# Altium schematic sheet rtc_blk - Copy.SchDoc
size A4; Engineer: JBayalas; DocumentNumber: 8; Revision: V5.0; SheetNumber: 8; SheetTotal: 10
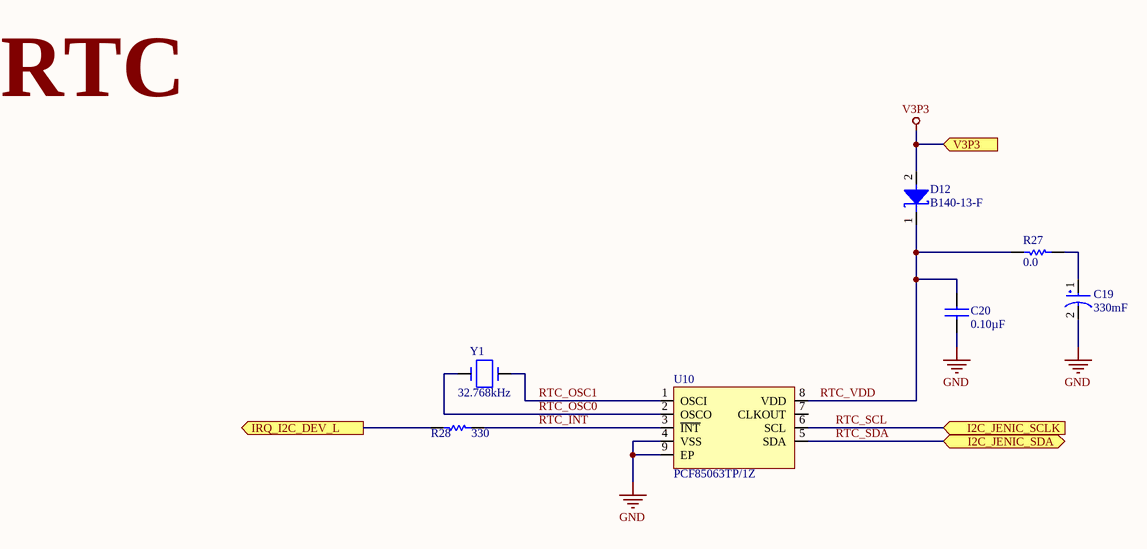
[diagram p0: rtc_blk - Copy.SchDoc]

## Parts
C19  value 330mF  [ELNA_DSK-3R3H334T-HL]  (hidden comment: DSK-3R3H334T-HL)
C20  value 0.10µF  [C0402]  (hidden comment: GRM155R71H104ME14D)
D12  value B140-13-F  [DO-214AC, SMA]  (hidden comment: *)
R27  value 0.0  [R0402]  (hidden comment: *)
R28  value 330  [R0402]  (hidden comment: *)
U10  PCF85063TP/1Z  [SON9P50_200X300X80L40X24T150N]
Y1  value 32.768kHz  [XTAL320X150X80L75X150N]  (hidden comment: FC-13532.7680KA-AG5)

## Ports
I2C_JENIC_SCLK (in), I2C_JENIC_SDA (bidir), IRQ_I2C_DEV_L (out), V3P3 (in)

## Nets
GND: C19.2 C20.2 U10.4(VSS) U10.9(EP)
V3P3: D12.2(anode) ; port V3P3
IRQ_I2C_DEV_L: R28.2 ; port IRQ_I2C_DEV_L
RTC_INT: R28.1 U10.3(~{INT})
RTC_OSC0: U10.2(OSCO) Y1.1
RTC_OSC1: U10.1(OSCI) Y1.2
RTC_SCL: U10.6(SCL) ; port I2C_JENIC_SCLK
RTC_SDA: U10.5(SDA) ; port I2C_JENIC_SDA
RTC_VDD: C20.1 D12.1(cathode) R27.1 U10.8(VDD)
NetC19_1: C19.1 R27.2

Not connected (* = marked no-connect by the designer): U10 7(CLKOUT)

## Notes on the sheet
- RTC
- Title:
- Sheet:
- Date:
- of
- Project:
- Revision:
- Engineer:
- WI4B S.r.l

## Library data of the parts
C19 = DSK-3R3H334T-HL: CAP 330MF -20% +80% 3.3V SMD; MFT: Elna; APN: CY-330M33A-X1-Z; MPN: DSK-3R3H334T-HL; RATING: 3.3V; LOAD: *; TYPE: SMD
C20 = GRM155R71H104ME14D: CAP CER 0.1UF 50V X7R 0402; MFT: Murata Electronics North America; TYPE: SMD; MPN: GRM155R71H104ME14D; RATING: 50V; DNP: *
D12 = B140-13-F: DIODE SCHOTTKY 40V 1A SMA; MFT: Diodes; TYPE: SMD; MPN: B140-13-F; RATING: 40V; LOAD: *
R27 = CRCW04020000Z0ED: RES SMD 0.0OHM JUMPER 1/16W 0402; MFT: Vishay Dale; RATING: 63mW; MPN: CRCW04020000Z0ED; TYPE: Surface Mount
R28 = CRCW0402330RFKED: RES SMD 330 OHM 1% 1/16W 0402; MFT: Vishay Dale; MPN: CRCW0402330RFKED; TYPE: SMD; RATING: 1/16W; LOAD: *
U10 = PCF85063TP/1Z: Real Time Clock Serial 8-Pin HWSON EP; MFT: NXP Semiconductors; APN: U8-RTC-SON8; VALUE: PCF85063TP/1Z; LOAD: *; RATING: *; TYPE: SMD; MPN: PCF85063TP/1Z
Y1 = FC-13532.7680KA-AG5: CRYSTAL 32.7680 KHZ 7.0PF SMD; MFT: Epson; APN: XZ-32761GH; MPN: FC-13532.7680KA-AG5; LOAD: *; RATING: *; TYPE: SMD